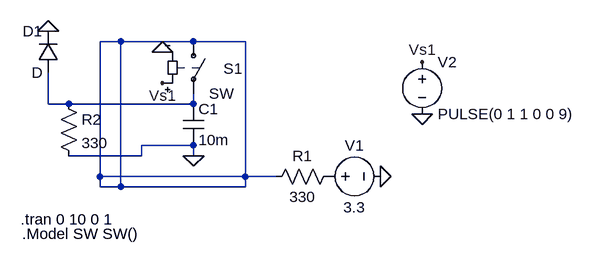
[diagram p0: schematic single_cap_test.asc]
single_cap_test.asc, the LTspice schematic file:
Version 4
SHEET 1 880 680
WIRE 32 64 0 64
WIRE 144 64 32 64
WIRE 224 64 144 64
WIRE -80 160 -80 112
WIRE -48 160 -80 160
WIRE 144 160 144 144
WIRE 144 160 -48 160
WIRE 144 224 64 224
WIRE 64 240 64 224
WIRE 64 240 -48 240
WIRE 144 240 144 224
WIRE 0 272 0 64
WIRE 224 272 224 64
WIRE 224 272 0 272
WIRE 272 272 224 272
WIRE 0 288 0 272
WIRE 32 288 32 64
WIRE 32 288 0 288
WIRE 224 288 224 272
WIRE 224 288 32 288
FLAG 432 272 0
FLAG 144 240 0
FLAG 96 128 Vs1
FLAG 96 80 0
FLAG 496 176 0
FLAG 496 96 Vs1
FLAG -80 48 0
SYMBOL res 368 256 R90
WINDOW 0 0 56 VBottom 2
WINDOW 3 32 56 VTop 2
SYMATTR InstName R1
SYMATTR Value 330
SYMBOL voltage 336 272 R270
WINDOW 0 32 56 VTop 2
WINDOW 3 -32 56 VBottom 2
WINDOW 123 0 0 Left 0
WINDOW 39 0 0 Left 0
SYMATTR InstName V1
SYMATTR Value 3.3
SYMBOL sw 144 48 R0
WINDOW 0 46 58 Left 2
SYMATTR InstName S1
SYMBOL voltage 496 80 R0
WINDOW 123 0 0 Left 0
WINDOW 39 0 0 Left 0
SYMATTR InstName V2
SYMATTR Value PULSE(0 1 1 0 0 9)
SYMBOL diode -64 112 R180
WINDOW 0 24 64 Left 2
WINDOW 3 24 0 Left 2
SYMATTR InstName D1
SYMBOL res -64 144 R0
SYMATTR InstName R2
SYMATTR Value 330
SYMBOL cap 128 160 R0
SYMATTR InstName C1
SYMATTR Value 10m
TEXT -122 338 Left 2 !.tran 0 10 0 1
TEXT -120 360 Left 2 !.Model SW SW()

The netlist it stands for:
* single_cap_test.asc
R1 P001 N001 330
V1 P001 0 3.3
S1 N001 N002 Vs1 0 SW
V2 Vs1 0 PULSE(0 1 1 0 0 9)
D1 N002 0 D
R2 N002 0 330
C1 N002 0 10m
.model D D
.lib standard.dio
.tran 0 10 0 1
.Model SW SW()
.backanno
.end